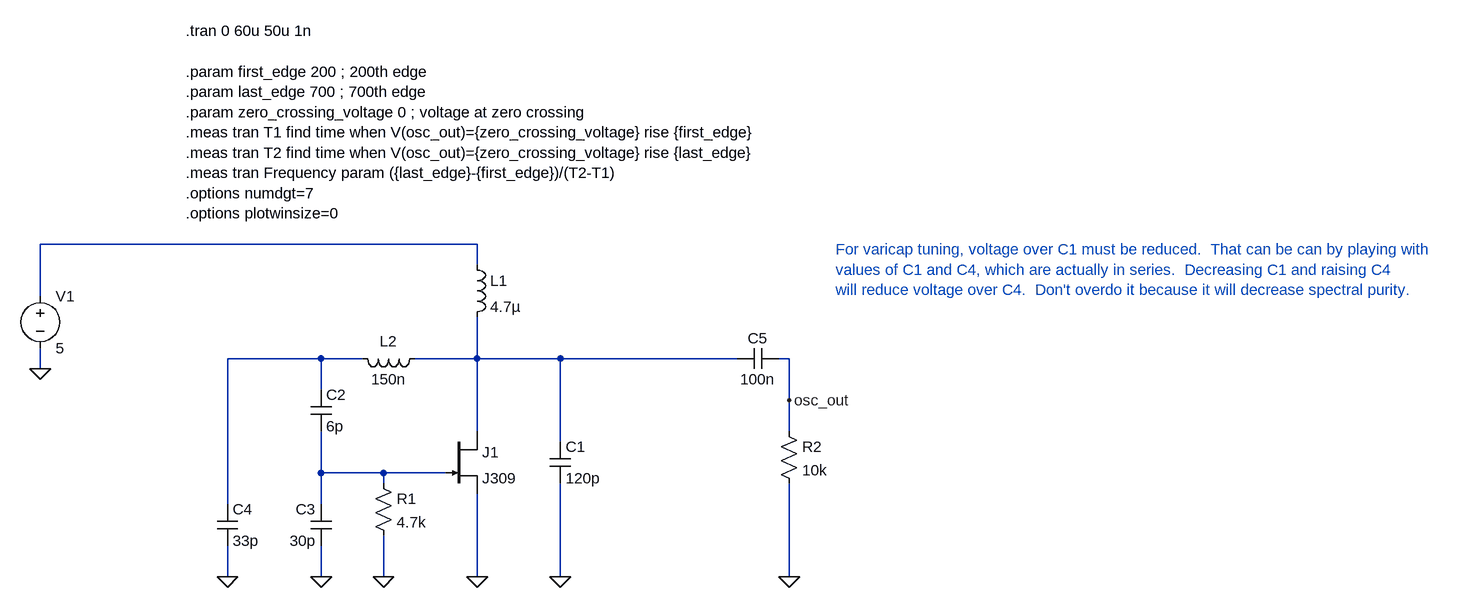
[diagram p0: schematic design1.asc]
design1.asc, the LTspice schematic file:
Version 4
SHEET 1 1232 820
WIRE -560 112 -1232 112
WIRE -560 144 -560 112
WIRE -1232 192 -1232 112
WIRE -800 288 -944 288
WIRE -736 288 -800 288
WIRE -560 288 -560 224
WIRE -560 288 -656 288
WIRE -432 288 -560 288
WIRE -160 288 -432 288
WIRE -80 288 -96 288
WIRE -1232 304 -1232 272
WIRE -800 336 -800 288
WIRE -80 352 -80 288
WIRE -560 400 -560 288
WIRE -80 400 -80 352
WIRE -432 416 -432 288
WIRE -800 464 -800 400
WIRE -704 464 -800 464
WIRE -608 464 -704 464
WIRE -704 480 -704 464
WIRE -944 512 -944 288
WIRE -800 512 -800 464
WIRE -944 624 -944 576
WIRE -800 624 -800 576
WIRE -704 624 -704 560
WIRE -560 624 -560 496
WIRE -432 624 -432 480
WIRE -80 624 -80 480
FLAG -1232 304 0
FLAG -944 624 0
FLAG -800 624 0
FLAG -560 624 0
FLAG -704 624 0
FLAG -432 624 0
FLAG -80 624 0
FLAG -80 352 osc_out
DATAFLAG -688 464 ""
SYMBOL njf -608 400 R0
SYMATTR InstName J1
SYMATTR Value J309
SYMBOL ind -576 128 R0
SYMATTR InstName L1
SYMATTR Value 4.7µ
SYMATTR SpiceLine Rser=1m
SYMBOL res -720 464 R0
SYMATTR InstName R1
SYMATTR Value 4.7k
SYMBOL cap -816 336 R0
SYMATTR InstName C2
SYMATTR Value 6p
SYMBOL cap -784 576 R180
WINDOW 0 24 56 Left 2
WINDOW 3 24 8 Left 2
SYMATTR InstName C3
SYMATTR Value 30p
SYMBOL cap -960 512 R0
SYMATTR InstName C4
SYMATTR Value 33p
SYMATTR SpiceLine Rpar=1meg
SYMBOL ind -640 272 R90
WINDOW 0 5 56 VBottom 2
WINDOW 3 32 56 VTop 2
SYMATTR InstName L2
SYMATTR Value 150n
SYMATTR SpiceLine Rser=0.1
SYMBOL voltage -1232 176 R0
WINDOW 123 0 0 Left 0
WINDOW 39 0 0 Left 0
SYMATTR InstName V1
SYMATTR Value 5
SYMBOL cap -448 416 R0
SYMATTR InstName C1
SYMATTR Value 120p
SYMBOL res -96 384 R0
SYMATTR InstName R2
SYMATTR Value 10k
SYMBOL cap -96 272 R90
WINDOW 0 0 32 VBottom 2
WINDOW 3 32 32 VTop 2
SYMATTR InstName C5
SYMATTR Value 100n
TEXT -1008 -216 Left 2 !.tran 0 60u 50u 1n\n \n.param first_edge 200 ; 200th edge\n.param last_edge 700 ; 700th edge\n.param zero_crossing_voltage 0 ; voltage at zero crossing\n.meas tran T1 find time when V(osc_out)={zero_crossing_voltage} rise {first_edge}\n.meas tran T2 find time when V(osc_out)={zero_crossing_voltage} rise {last_edge}\n.meas tran Frequency param ({last_edge}-{first_edge})/(T2-T1)\n.options numdgt=7\n.options plotwinsize=0
TEXT -8 120 Left 2 ;For varicap tuning, voltage over C1 must be reduced.  That can be can by playing with\nvalues of C1 and C4, which are actually in series.  Decreasing C1 and raising C4\nwill reduce voltage over C4.  Don't overdo it because it will decrease spectral purity.

The netlist it stands for:
* design1.asc
J1 N003 N004 0 J309
L1 N001 N003 4.7µ Rser=1m
R1 N004 0 4.7k
C2 N002 N004 6p
C3 0 N004 30p
C4 N002 0 33p Rpar=1meg
L2 N003 N002 150n Rser=0.1
V1 N001 0 5
C1 N003 0 120p
R2 osc_out 0 10k
C5 osc_out N003 100n
.model NJF NJF
.model PJF PJF
.lib standard.jft
.tran 0 60u 50u 1n
.param first_edge 200 ; 200th edge
.param last_edge 700 ; 700th edge
.param zero_crossing_voltage 0 ; voltage at zero crossing
.meas tran T1 find time when V(osc_out)={zero_crossing_voltage} rise {first_edge}
.meas tran T2 find time when V(osc_out)={zero_crossing_voltage} rise {last_edge}
.meas tran Frequency param ({last_edge}-{first_edge})/(T2-T1)
.options numdgt=7
.options plotwinsize=0
* For varicap tuning, voltage over C1 must be reduced.  That can be can by playing with
* values of C1 and C4, which are actually in series.  Decreasing C1 and raising C4
* will reduce voltage over C4.  Don't overdo it because it will decrease spectral purity.
.backanno
.end